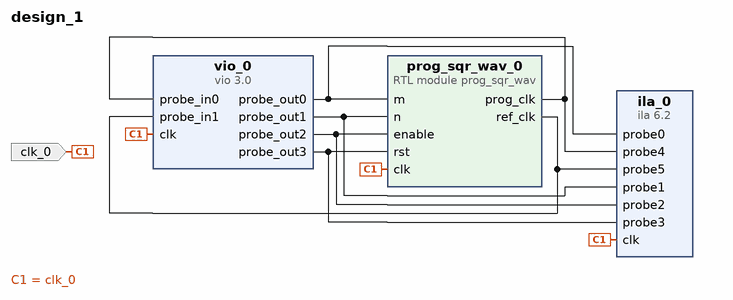
[diagram p0: block diagram of the top level]
# Vivado block design design_1, xc7z020clg484-1, Vivado 2024.1
create_bd_design design_1

create_bd_port -dir I -type clk clk_0

create_bd_cell -type ip -vlnv xilinx.com:ip:vio:3.0 vio_0
set_property -dict [list \
  CONFIG.C_NUM_PROBE_IN 2 \
  CONFIG.C_NUM_PROBE_OUT 4 \
  CONFIG.C_PROBE_OUT0_WIDTH 4 \
  CONFIG.C_PROBE_OUT1_WIDTH 4 \
] [get_bd_cells vio_0]
create_bd_cell -type module -reference prog_sqr_wav prog_sqr_wav_0
create_bd_cell -type ip -vlnv xilinx.com:ip:ila:6.2 ila_0
set_property -dict {CONFIG.C_DATA_DEPTH 65536 CONFIG.C_MONITOR_TYPE Native CONFIG.C_NUM_OF_PROBES 6} [get_bd_cells ila_0]

# ---- connections ----

connect_bd_net -net clk_0_1 [get_bd_ports clk_0] [get_bd_pins prog_sqr_wav_0/clk] [get_bd_pins vio_0/clk] [get_bd_pins ila_0/clk]
connect_bd_net [get_bd_pins prog_sqr_wav_0/prog_clk] [get_bd_pins vio_0/probe_in0] [get_bd_pins ila_0/probe4]
connect_bd_net [get_bd_pins prog_sqr_wav_0/ref_clk] [get_bd_pins vio_0/probe_in1] [get_bd_pins ila_0/probe5]
connect_bd_net [get_bd_pins vio_0/probe_out0] [get_bd_pins prog_sqr_wav_0/m] [get_bd_pins ila_0/probe0]
connect_bd_net [get_bd_pins vio_0/probe_out1] [get_bd_pins prog_sqr_wav_0/n] [get_bd_pins ila_0/probe1]
connect_bd_net [get_bd_pins vio_0/probe_out2] [get_bd_pins prog_sqr_wav_0/enable] [get_bd_pins ila_0/probe2]
connect_bd_net [get_bd_pins vio_0/probe_out3] [get_bd_pins prog_sqr_wav_0/rst] [get_bd_pins ila_0/probe3]

validate_bd_design
save_bd_design
